# Altium schematic sheet adc.SchDoc: ADC
size A4 portrait; DocumentNumber: 7; Revision: betaV1.0; SheetNumber: 7; SheetTotal: 8; Organization: 合肥弗雷电子; Address1: 玉兰大道14号D栋3楼; Address2: 肥西县桃花镇; Address3: 合肥市; Address4: 安徽省
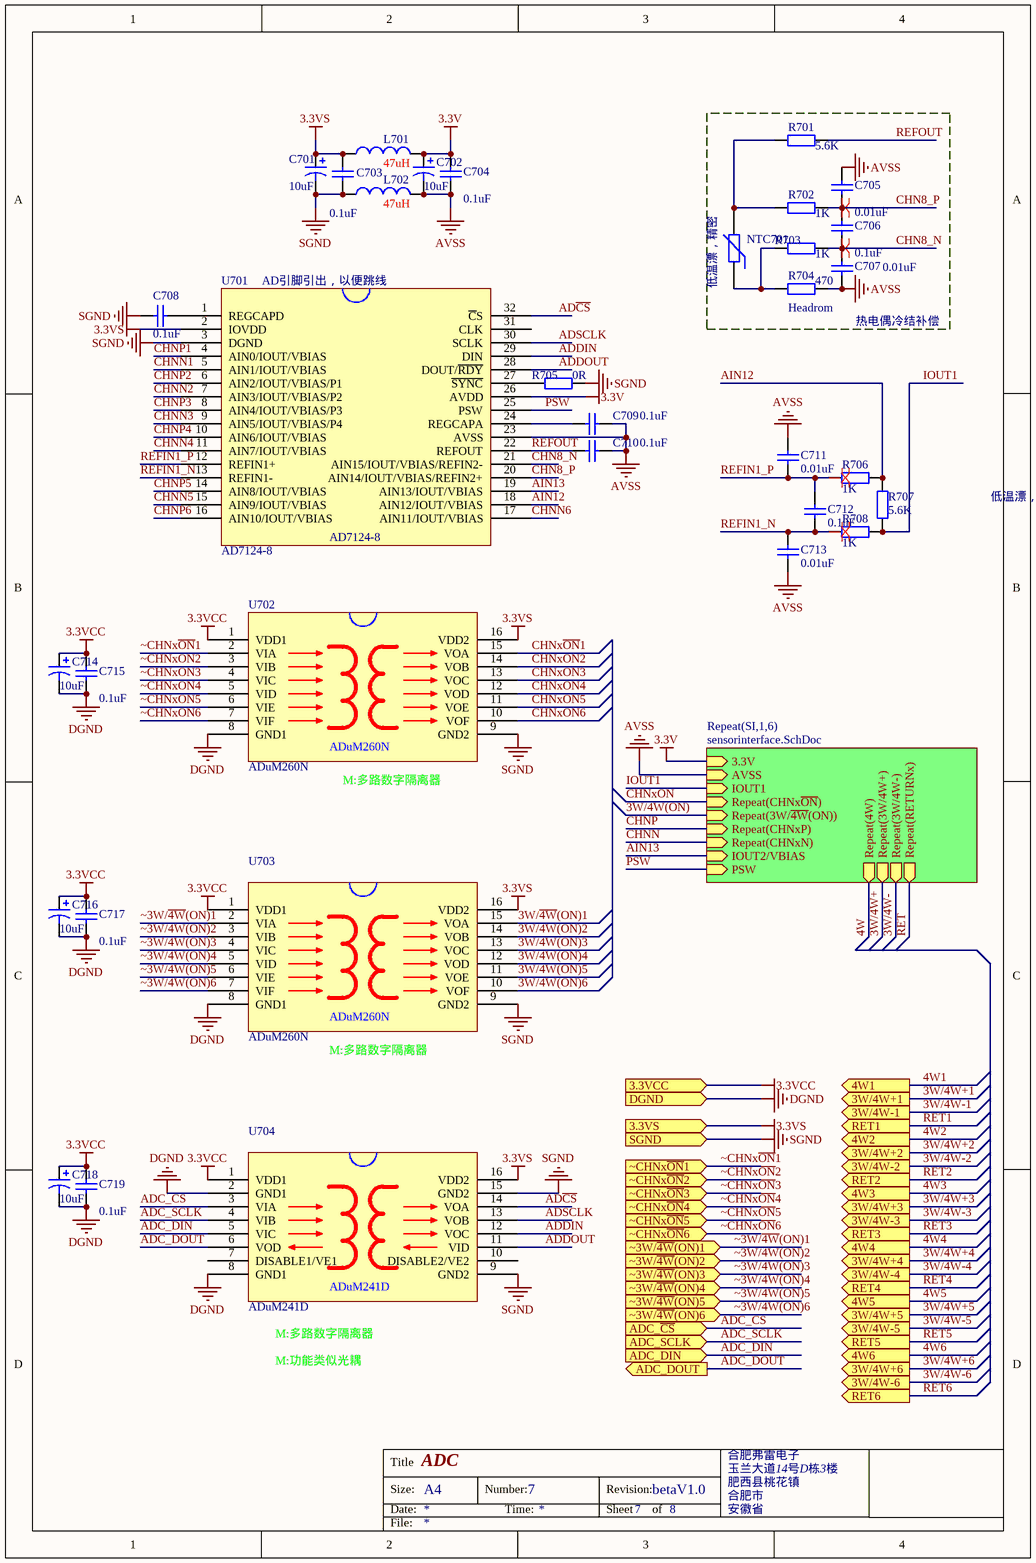
[diagram p0: adc.SchDoc]

## Parts
C701  value 10uF  [CB]  (hidden comment: T494B106M006AHAUTO)
C702  value 10uF  [CB]  (hidden comment: T494B106M006AHAUTO)
C703  value 0.1uF  [0603C]  (hidden comment: CC0805MRX7R9BB104)
C704  value 0.1uF  [0603C]  (hidden comment: CC0805MRX7R9BB104)
C705  value 0.01uF  [0603C]  (hidden comment: CC0805MRX7R9BB103)
C706  value 0.1uF  [0603C]  (hidden comment: CC0805MRX7R9BB104)
C707  value 0.01uF  [0603C]  (hidden comment: CC0805MRX7R9BB103)
C708  value 0.1uF  [0603C]  (hidden comment: CC0805MRX7R9BB104)
C709  value 0.1uF  [0603C]  (hidden comment: CC0805MRX7R9BB104)
C710  value 0.1uF  [0603C]  (hidden comment: CC0805MRX7R9BB104)
C711  value 0.01uF  [0603C]  (hidden comment: CC0805MRX7R9BB103)
C712  value 0.1uF  [0603C]  (hidden comment: CC0805MRX7R9BB104)
C713  value 0.01uF  [0603C]  (hidden comment: CC0805MRX7R9BB103)
C714  value 10uF  [CB]  (hidden comment: T494B106M006AHAUTO)
C715  value 0.1uF  [0603C]  (hidden comment: CC0805MRX7R9BB104)
C716  value 10uF  [CB]  (hidden comment: T494B106M006AHAUTO)
C717  value 0.1uF  [0603C]  (hidden comment: CC0805MRX7R9BB104)
C718  value 10uF  [CB]  (hidden comment: T494B106M006AHAUTO)
C719  value 0.1uF  [0603C]  (hidden comment: CC0805MRX7R9BB104)
L701  value 47uH  [0805r]  (hidden comment: VLS4012HBX-150M)
L702  value 47uH  [0805r]  (hidden comment: VLS4012HBX-150M)
NTC701  NTCS0805E3103JHT  [0805r]  (value not drawn)
R701  value 5.6K  [0603R]  (hidden comment: RC0805JR-075600RL)
R702  value 1K  [0603R]  (hidden comment: RC0805JR-071KL)
R703  value 1K  [0603R]  (hidden comment: RC0805JR-071KL)
R704  value 470  [0603R]  (hidden comment: RC0805JR-07470RL)
R705  value 0R  [0603R]  (hidden comment: RC0805JR-000KL)
R706  value 1K  [0603R]  (hidden comment: RC0805JR-071KL)
R707  value 5.6K  [0603R]  (hidden comment: RC0805JR-075600RL)
R708  value 1K  [0603R]  (hidden comment: RC0805JR-071KL)
U701  AD7124-8  [TI-RHB32-3150X3150TP_V]
U702  ADuM260N  [SOIC-16]
U703  ADuM260N  [SOIC-16]
U704  ADuM241D  [SOIC-16]

## Sub-sheets
Repeat(SI,1,6) = sensorinterface.SchDoc: Repeat(4W) (out), 3.3V (in), AVSS (in), IOUT1 (in), Repeat(3W/4W-) (out), Repeat(CHNxN) (in), IOUT2/VBIAS (in), Repeat(RETURNx) (out), Repeat(3W/4W+) (out), PSW (in), Repeat(3W/~{4W}(ON)) (in), Repeat(CHNxP) (in), Repeat(CHNx~{ON}) (in)

## Ports
3.3VCC (in), 3.3VS (in), 3W/4W+1 (out), 3W/4W+2 (out), 3W/4W+3 (out), 3W/4W+4 (out), 3W/4W+5 (out), 3W/4W+6 (out), 3W/4W-1 (out), 3W/4W-2 (out), 3W/4W-3 (out), 3W/4W-4 (out), 3W/4W-5 (out), 3W/4W-6 (out), 4W1 (out), 4W2 (out), 4W3 (out), 4W4 (out), 4W5 (out), 4W6 (out), ADC_DIN (in), ADC_DOUT (out), ADC_SCLK (in), ADC_~{CS} (in), DGND (in), RET1 (out), RET2 (out), RET3 (out), RET4 (out), RET5 (out), RET6 (out), SGND (in), ~3W/~{4W}(ON)1 (in), ~3W/~{4W}(ON)2 (in), ~3W/~{4W}(ON)3 (in), ~3W/~{4W}(ON)4 (in), ~3W/~{4W}(ON)5 (in), ~3W/~{4W}(ON)6 (in), ~CHNx~{ON}1 (in), ~CHNx~{ON}2 (in), ~CHNx~{ON}3 (in), ~CHNx~{ON}4 (in), ~CHNx~{ON}5 (in), ~CHNx~{ON}6 (in)

## Nets
3.3V: C702.1 C704.1 L701.2 U701.26(AVDD) ; sheet Repeat(SI,1,6)/3.3V
3.3VCC: C714.1 C715.1 C716.1 C717.1 C718.1 C719.1 U702.1(VDD1) U703.1(VDD1) U704.1(VDD1) ; port 3.3VCC
3.3VS: C701.1 C703.1 L701.1 U701.2(IOVDD) U702.16(VDD2) U703.16(VDD2) U704.16(VDD2) ; port 3.3VS
AVSS: C702.2 C704.2 C705.2 C707.2 C709.1 C710.1 C711.2 C713.2 L702.2 R704.1 U701.23(AVSS) ; sheet Repeat(SI,1,6)/AVSS
DGND: C714.2 C715.2 C716.2 C717.2 C718.2 C719.2 U702.8(GND1) U703.8(GND1) U704.2(GND1) U704.8(GND1) ; port DGND
SGND: C701.2 C703.2 C708.1 L702.1 R705.2 U701.3(DGND) U702.9(GND2) U703.9(GND2) U704.9(GND2) U704.15(GND2) ; port SGND
3W/~{4W}(ON): sheet Repeat(SI,1,6)/Repeat(3W/~{4W}(ON))
3W/~{4W}(ON)1: U703.15(VOA)
3W/~{4W}(ON)2: U703.14(VOB)
3W/~{4W}(ON)3: U703.13(VOC)
3W/~{4W}(ON)4: U703.12(VOD)
3W/~{4W}(ON)5: U703.11(VOE)
3W/~{4W}(ON)6: U703.10(VOF)
3W/4W+: sheet Repeat(SI,1,6)/Repeat(3W/4W+)
3W/4W+1: port 3W/4W+1
3W/4W+2: port 3W/4W+2
3W/4W+3: port 3W/4W+3
3W/4W+4: port 3W/4W+4
3W/4W+5: port 3W/4W+5
3W/4W+6: port 3W/4W+6
3W/4W-: sheet Repeat(SI,1,6)/Repeat(3W/4W-)
3W/4W-1: port 3W/4W-1
3W/4W-2: port 3W/4W-2
3W/4W-3: port 3W/4W-3
3W/4W-4: port 3W/4W-4
3W/4W-5: port 3W/4W-5
3W/4W-6: port 3W/4W-6
4W: sheet Repeat(SI,1,6)/Repeat(4W)
4W1: port 4W1
4W2: port 4W2
4W3: port 4W3
4W4: port 4W4
4W5: port 4W5
4W6: port 4W6
AD~{CS}: U701.32(~{C}S) U704.14(VOA)
ADC_~{CS}: U704.3(VIA) ; port ADC_~{CS}
ADC_DIN: U704.5(VIC) ; port ADC_DIN
ADC_DOUT: U704.6(VOD) ; port ADC_DOUT
ADC_SCLK: U704.4(VIB) ; port ADC_SCLK
ADDIN: U701.29(DIN) U704.12(VOC)
ADDOUT: U701.28(DOUT/~{RDY}) U704.11(VID)
ADSCLK: U701.30(SCLK) U704.13(VOB)
AIN12: R706.2 R707.2 U701.18(AIN12/IOUT/VBIAS)
AIN13: U701.19(AIN13/IOUT/VBIAS) ; sheet Repeat(SI,1,6)/IOUT2/VBIAS
CHN8_N: C706.2 C707.1 R703.1 U701.21(AIN15/IOUT/VBIAS/REFIN2-)
CHN8_P: C705.1 C706.1 R702.1 U701.20(AIN14/IOUT/VBIAS/REFIN2+)
CHNN: sheet Repeat(SI,1,6)/Repeat(CHNxN)
CHNN1: U701.5(AIN1/IOUT/VBIAS)
CHNN2: U701.7(AIN3/IOUT/VBIAS/P2)
CHNN3: U701.9(AIN5/IOUT/VBIAS/P4)
CHNN4: U701.11(AIN7/IOUT/VBIAS)
CHNN5: U701.15(AIN9/IOUT/VBIAS)
CHNN6: U701.17(AIN11/IOUT/VBIAS)
CHNP: sheet Repeat(SI,1,6)/Repeat(CHNxP)
CHNP1: U701.4(AIN0/IOUT/VBIAS)
CHNP2: U701.6(AIN2/IOUT/VBIAS/P1)
CHNP3: U701.8(AIN4/IOUT/VBIAS/P3)
CHNP4: U701.10(AIN6/IOUT/VBIAS)
CHNP5: U701.14(AIN8/IOUT/VBIAS)
CHNP6: U701.16(AIN10/IOUT/VBIAS)
CHNx~{ON}: sheet Repeat(SI,1,6)/Repeat(CHNx~{ON})
CHNx~{ON}1: U702.15(VOA)
CHNx~{ON}2: U702.14(VOB)
CHNx~{ON}3: U702.13(VOC)
CHNx~{ON}4: U702.12(VOD)
CHNx~{ON}5: U702.11(VOE)
CHNx~{ON}6: U702.10(VOF)
IOUT1: R707.1 R708.2 ; sheet Repeat(SI,1,6)/IOUT1
PSW: U701.25(PSW) ; sheet Repeat(SI,1,6)/PSW
REFIN1_N: C712.2 C713.1 R708.1 U701.13(REFIN1-)
REFIN1_P: C711.1 C712.1 R706.1 U701.12(REFIN1+)
REFOUT: C710.2 R701.1 U701.22(REFOUT)
RET: sheet Repeat(SI,1,6)/Repeat(RETURNx)
RET1: port RET1
RET2: port RET2
RET3: port RET3
RET4: port RET4
RET5: port RET5
RET6: port RET6
~3W/~{4W}(ON)1: U703.2(VIA) ; port ~3W/~{4W}(ON)1
~3W/~{4W}(ON)2: U703.3(VIB) ; port ~3W/~{4W}(ON)2
~3W/~{4W}(ON)3: U703.4(VIC) ; port ~3W/~{4W}(ON)3
~3W/~{4W}(ON)4: U703.5(VID) ; port ~3W/~{4W}(ON)4
~3W/~{4W}(ON)5: U703.6(VIE) ; port ~3W/~{4W}(ON)5
~3W/~{4W}(ON)6: U703.7(VIF) ; port ~3W/~{4W}(ON)6
~CHNx~{ON}1: U702.2(VIA) ; port ~CHNx~{ON}1
~CHNx~{ON}2: U702.3(VIB) ; port ~CHNx~{ON}2
~CHNx~{ON}3: U702.4(VIC) ; port ~CHNx~{ON}3
~CHNx~{ON}4: U702.5(VID) ; port ~CHNx~{ON}4
~CHNx~{ON}5: U702.6(VIE) ; port ~CHNx~{ON}5
~CHNx~{ON}6: U702.7(VIF) ; port ~CHNx~{ON}6
NetC708_2: C708.2 U701.1(REGCAPD)
NetC709_2: C709.2 U701.24(REGCAPA)
NetNTC701_1: NTC701.1 R703.2 R704.2
NetNTC701_2: NTC701.2 R701.2 R702.2
NetR705_1: R705.1 U701.27(~{SYNC})

Not connected (* = marked no-connect by the designer): U701 31(CLK); U704 7(DISABLE1/VE1) 10(DISABLE2/VE2)

## Layout directives
differential pair: CHN8_N, CHN8_P, REFIN1_N, REFIN1_P

## Notes on the sheet
- (near U701) AD引脚引出，以便跳线
- (near NTC701) 低温漂，精密
- (near R704) Headrom
- 热电偶冷结补偿
- 低温漂，精密
- (near U702) M:多路数字隔离器
- (near U703) M:多路数字隔离器
- M:多路数字隔离器
- M:功能类似光耦
- Title
- Size:
- Date:
- A4
- Number:
- Time:
- Revision:
- Sheet
- of
- File:

## Library data of the parts
C701 C702 C714 C716 C718 = Cap Pol1: Polarized Capacitor (Radial); Published: 8-Jun-2000; LatestRevisionDate: 17-Jul-2002; LatestRevisionNote: Re-released for DXP Platform.; PackageReference: RB7.6-15; Publisher: Altium Limited; PackageDescription: Polarized Capacitor (Radial); 2 Leads
C703-C713 C715 C717 C719 = Cap: Capacitor; Published: 8-Jun-2000; LatestRevisionDate: 17-Jul-2002; LatestRevisionNote: Re-released for DXP Platform.; PackageReference: RAD-0.3; Publisher: Altium Limited; PackageDescription: Radial Cap, Thru-Hole; 2 Leads; 0.3 in Pin Spacing
L701 L702 = Inductor
NTC701 = Res Varistor: Varistor (Voltage-Sensitive Resistor); Published: 24-Mar-1999; LatestRevisionDate: 29-May-2009; LatestRevisionNote: IPC-7351 Footprint Added.; PackageVersion: Mar-2003; PackageReference: 6-0805; Publisher: Altium Limited; PackageDescription: Chip Resistor 0805 Case Size; Code_IPC: RESC2012
R701-R708 = Res2: Resistor; Published: 8-Jun-2000; LatestRevisionDate: 17-Jul-2002; LatestRevisionNote: Re-released for DXP Platform.; PackageReference: AXIAL-0.4; Publisher: Altium Limited; PackageDescription: Axial Device, Thru-Hole; 2 Leads; 0.4 in Pin Spacing